# EAGLE design 5-Way_Tactile_Switch_BOB_v11 (EAGLE 8.0.1)
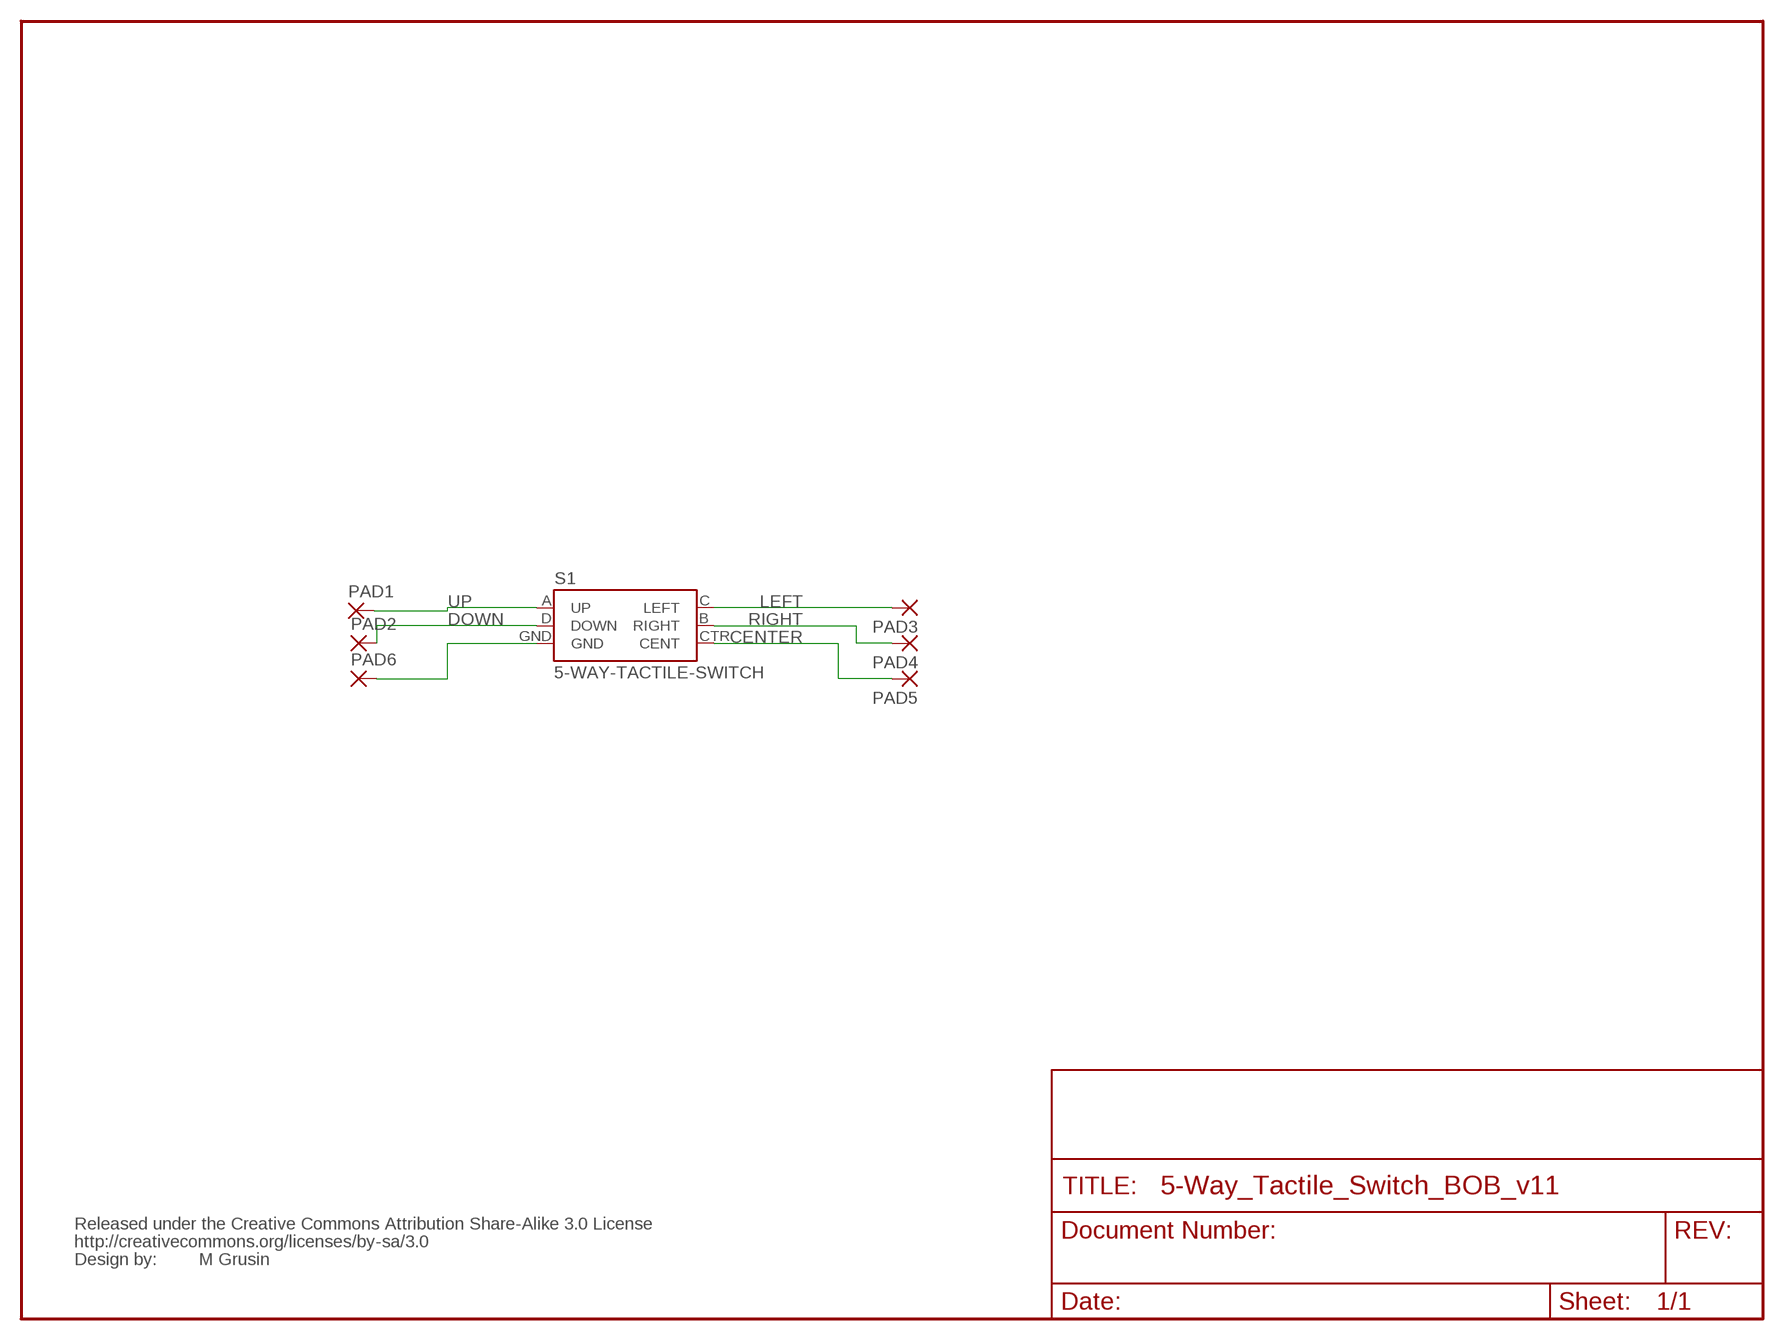
[diagram p0: schematic, sheet 1]

## Parts
PAD1  SMD2  [SMD1,27-2,54]
PAD2  SMD2  [SMD1,27-2,54]
PAD3  SMD2  [SMD1,27-2,54]
PAD4  SMD2  [SMD1,27-2,54]
PAD5  SMD2  [SMD1,27-2,54]
PAD6  SMD2  [SMD1,27-2,54]
S1  5-WAY-TACTILE-SWITCH  JOYSTICK_MINI  [JOYSTICK_MINI]
U$2  CREATIVE_COMMONS  [CREATIVE_COMMONS]

## Nets
CENTER: PAD5.1(P) S1.CTR(CENT)
DOWN: PAD2.1(P) S1.D(DOWN)
GND: PAD6.1(P) S1.GND
LEFT: PAD3.1(P) S1.C(LEFT)
RIGHT: PAD4.1(P) S1.B(RIGHT)
UP: PAD1.1(P) S1.A(UP)

## Notes on the sheet
- M Grusin

## Library data of the parts
PAD1-PAD6 = wirepad:SMD2: SMD PAD
S1 = SparkFun-Electromechanical:JOYSTICK_MINI: Small 5-way tactile joystick, COM-10063 4UCON SF303GJ26
U$2 = SparkFun:CREATIVE_COMMONS

## Board
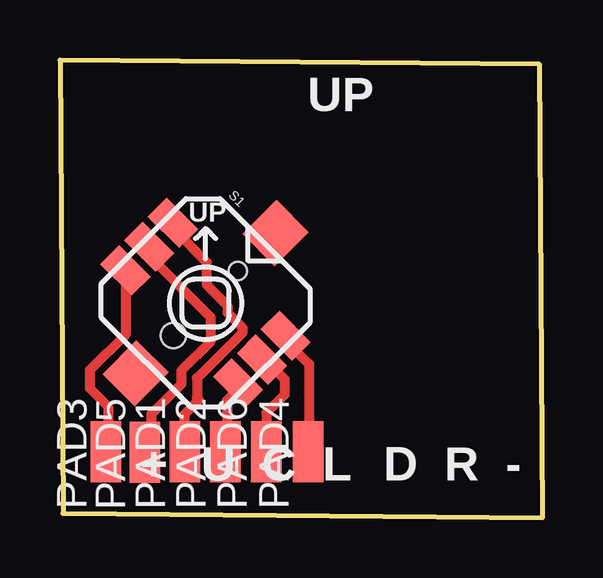
[diagram p1: board, top side]
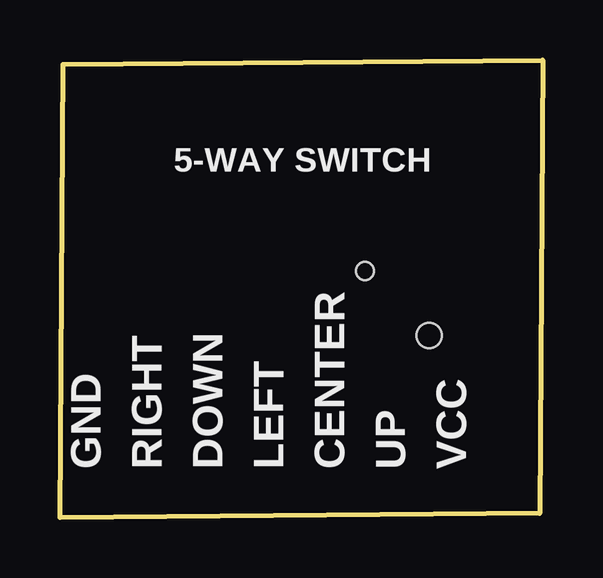
[diagram p2: board, bottom side, seen from below]

Size 20.13 x 19.07 mm. Coordinates in mm from the lower left corner, seen from the top.
Outline: 0.13,0.18 20.13,0 20,18.89 0,19.07 0.13,0.18
Copper layers (1*16): Top 0.035mm / dielectric 1.5mm / Bottom 0.035mm
Design rules "default": minimum track width 8mil, minimum drill 20mil, track to track 8mil, track to pad 8mil, pad to pad 8mil, via to via 8mil, smd to smd 8mil, copper to edge 8mil, drill to drill 8mil, minimum pad ring 12mil, minimum via ring 10mil, stop-mask expansion 4mil, vias tented up to drill 20mil, thermal gap 10mil

### Footprints (pad centres in the part's own frame; a part is rotated, then mirrored left to right if it is on the bottom)
SMD1,27-2,54 = smd 1.27 x 2.54: 1 0,0
JOYSTICK_MINI = smd 1.85 x 1.1: A -3.325,1.4; B 3.325,1.4; C -3.325,-1.4; CTR -3.325,0; D 3.325,-1.4; GND 3.325,0 | smd 1.9 x 2: NC 0,4.13; NC@0 0,-4.13 | hole 0.75: 0,1.9 | hole 1.05: 0,-1.9

### Placement (x,y rotation side)
PAD1  5.2,2.74 0 top
PAD2  6.89,2.75 0 top
PAD3  1.93,2.75 0 top
PAD4  10.36,2.75 0 top
PAD5  3.54,2.73 0 top
PAD6  8.61,2.75 0 top
S1  6.07,8.94 315 top
U$2  -19.05,-13.54 0 top  (outside the outline)

### Tracks (layer width: path | path; a pad name or v marks a point on that pad's centre or on a via)
CENTER
  Top 0.406: S1.CTR 3.72,10.91 6.27,8.36 6.27,7.34 5.05,6.12 5.05,5.56 3.81,4.32 3.81,3 PAD5.1
DOWN
  Top 0.406: 7.34,5.51 S1.D 7.43,5.35 6.96,4.88 6.96,2.82 PAD2.1
GND
  Top 0.406: S1.GND 8.55,6.59 9.37,5.77 9.37,5.13 8.61,4.37 PAD6.1
LEFT
  Top 0.406: S1.C 2.73,7.63 1.25,6.15 1.25,5.38 2.01,4.62 2.01,2.83 PAD3.1
RIGHT
  Top 0.406: S1.B 9.41,7.38 10.39,6.4 10.39,2.78 PAD4.1
UP
  Top 0.406: S1.A 4.71,12.05 6.12,10.64 6.12,9.7 6.99,8.84 6.99,8.55 7.61,7.92 7.61,7.84 7.61,7.71 5.71,5.82 5.71,4.98 5.79,4.9 5.18,4.29 5.18,2.76 PAD1.1

### Text on the board
tPlace: UP | + | U | C | L | D | R | -
bPlace: 5-WAY SWITCH | VCC | UP | CENTER | LEFT | DOWN | RIGHT | GND
tValues: M Grusin
Document: 0.00" | 0.10" | 0.15" | 0.45" | 0.80" | 0.90" | 0.80" | 0.70" | 0.50" | 0.30" | 0.05" | 0.00"